# EAGLE design controller (EAGLE 7.5.0)
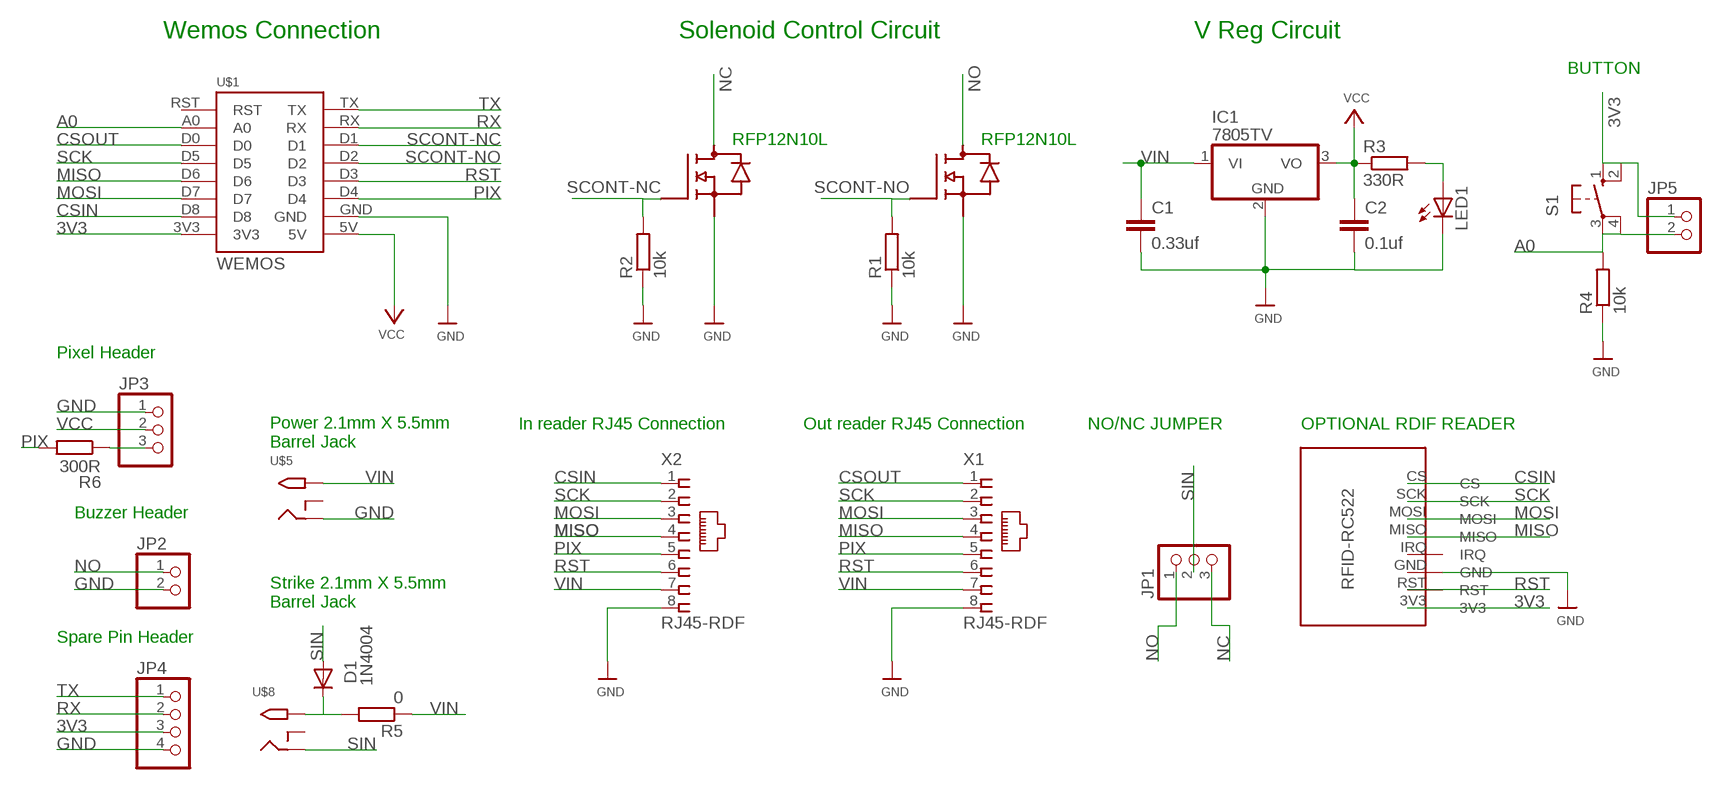
[diagram p0: schematic, sheet 1]

## Parts
C1  0.33uf  C-EU050-024X044  [C050-024X044]
C2  0.1uf  C-EU050-024X044  [C050-024X044]
D1  1N4004  [DO41-10]
IC1  7805TV  [TO220V]
IC2  NTD4963NT0220  [T0220]
IC3  NTD4963NT0220  [T0220]
JP1  PINHD-1X3CB  [1X03-CLEANBIG]
JP2  PINHD-1X2  [1X02]
JP3  PINHD-1X3CB  [1X03-CLEANBIG]
JP4  PINHD-1X4  [1X04]
JP5  PINHD-1X2  [1X02]
LED1  LED3MM  [LED3MM]
R1  10k  R-EU_0204/5  [0204/5]
R2  10k  R-EU_0204/5  [0204/5]
R3  330R  R-EU_0204/5  [0204/5]
R4  10k  R-EU_0204/5  [0204/5]
R5  0  R-EU_0204/5  [0204/5]
R6  300R  R-EU_0204/5  [0204/5]
S1  10-XX  [B3F-10XX]
U$1  WEMOS  [WEMOS]
U$5  2.1MMJACKTHM  [PJ-102A]
U$8  2.1MMJACKTHM  [PJ-102A]
U$14  RFID-RC522NOHOLES  [RFID-RC522-NOHOLES]
X1  RJ45-RDF  [RJ45-RDF]
X2  RJ45-RDF  [RJ45-RDF]

## Nets
3V3: JP4.3 JP5.1 S1.1(S) S1.2(S1) U$1.3V3 U$14.3V3
A0: JP5.2 R4.2 S1.3(P) S1.4(P1) U$1.A0
CSIN: U$1.D8 U$14.CS X2.1
CSOUT: U$1.D0 X1.1
GND: C1.2 C2.2 IC1.2(GND) IC2.3(S) IC3.3(S) JP2.2 JP3.1 JP4.4 LED1.K(C) R1.1 R2.1 R4.1 U$1.GND U$5.RING X1.8 X2.8
MISO: U$1.D6 U$14.MISO X1.4 X2.4
MOSI: U$1.D7 U$14.MOSI X1.3 X2.3
N$1: D1.C R5.2 U$8.TIP
N$4: JP3.3 R6.1
N$11: LED1.A R3.2
NC: IC2.2(D) JP1.3
NO: IC3.2(D) JP1.1 JP2.1
PIX: R6.2 U$1.D4 X1.5 X2.5
RST: U$1.D3 U$14.RST X1.6 X2.6
RX: JP4.2 U$1.RX
SCK: U$1.D5 U$14.SCK X1.2 X2.2
SCONT-NC: IC2.1(G) R2.2 U$1.D1
SCONT-NO: IC3.1(G) R1.2 U$1.D2
SIN: D1.A JP1.2 U$8.RING
TX: JP4.1 U$1.TX
VCC: C2.1 IC1.3(VO) JP3.2 R3.1 U$1.5V
VIN: C1.1 IC1.1(VI) R5.1 U$5.TIP X1.7 X2.7
Unconnected: U$1.RST U$5.RING_SW U$8.RING_SW U$14.GND U$14.IRQ

## Notes on the sheet
- Wemos Connection | Solenoid Control Circuit | V Reg Circuit
- BUTTON
- RFP12N10L | RFP12N10L
- Pixel Header
- In reader RJ45 Connection | Out reader RJ45 Connection | NO/NC JUMPER | OPTIONAL RDIF READER
- Power 2.1mm X 5.5mm
  Barrel Jack
- Buzzer Header
- Strike 2.1mm X 5.5mm
  Barrel Jack
- Spare Pin Header

## Library data of the parts
C1 C2 = rcl:C-EU: CAPACITOR, European symbol
D1 = adafruit:1N4004: DIODE General purpose 1N400x type rectifier (With bigger pads) http://www.ladyada.net/library/pcb/eaglelibrary.html
IC1 = linear:78*: Positive VOLTAGE REGULATOR Source: http://cache.national.com/ds/LM/LM78L05.pdf http://www.fairchildsemi.com/ds/LM/LM7805.pdf
IC2 IC3 = amino:NTD4963N
JP1 JP3 = adafruit:PINHD-1X3: PIN HEADER
JP2 JP5 = pinhead:PINHD-1X2: PIN HEADER
JP4 = pinhead:PINHD-1X4: PIN HEADER
LED1 = adafruit:LED: LED OSRAM: - CHIPLED LG R971, LG N971, LY N971, LG Q971, LY Q971, LO R971, LY R971 LH N974, LH R974 LS Q976, LO Q976, LY Q976 LO Q996 - Hyper CHIPLED LW Q18S LB Q993, LB Q99A, LB R99A - SideLED LS A670, LO A670, LY A670, LG A670, LP A670 LB A673, LV A673, LT A673, LW A673 LH A674 LY A675 LS A676, LA A676, LO A676, LY A676, LW A676 LS A679, LY A679, LG A679 - Hyper Micro SIDELED® LS Y876, LA Y876, LO Y876, LY Y876 LT Y87S - SmartLED LW L88C, LW L88S LB L89C, LB L89S, LG L890 LS L89K, LO L89K, LY L89K LS L896, LA L896, LO L896, LY L896 - TOPLED LS T670, LO T670, LY T670, LG T670, LP T670 LSG T670, LSP T670, LSY T670, LOP T670, LYG T670 LG T671, LOG T671, LSG T671 LB T673, LV T673, LT T673, LW T673 LH T674 LS T676, LA T676, LO T676, LY T676, LB T676, LH T676, LSB T676, LW T676 LB T67C, LV T67C, LT T67C, LS T67K, LO T67K, LY T67K, LW E67C LS E67B, LA E67B, LO E67B, LY E67B, LB E67C, LV E67C, LT E67C LW T67C LS T679, LY T679, LG T679 LS T770, LO T770, LY T770, LG T770, LP T770 LB T773, LV T773, LT T773, LW T773 LH T774 LS E675, LA E675, LY E675, LS T675 LS T776, LA T776, LO T776, LY T776, LB T776 LHGB T686 LT T68C, LB T68C - Hyper Mini TOPLED® LB M676 - Mini TOPLED Santana® LG M470 LS M47K, LO M47K, LY M47K Source: http://www.osram.convergy.de/
R1-R6 = resistor:R-EU_: RESISTOR, European symbol
S1 = switch-omron:10-XX: OMRON SWITCH; MPN: B3F-1000; OC_FARNELL: 176432; OC_NEWARK: 36M3542
U$1 = wemos:WEMOS
U$5 U$8 = adafruit:2.1MMJACK: 2.1mm x 5.5mm THM DC jack with internal switch. Digikey part #PJ-102A, 4UCON part #05537 2.1mm x 5.5mm SMT DC jack with internal switch. Digikey part #PJ-002A-SMT, 4UCON part #03267 By microbuilder.eu & adafruit.com
U$14 = Rdf:RFID-RC522
X1 X2 = con-tycoelectronics:RJ45-RDF

## Board
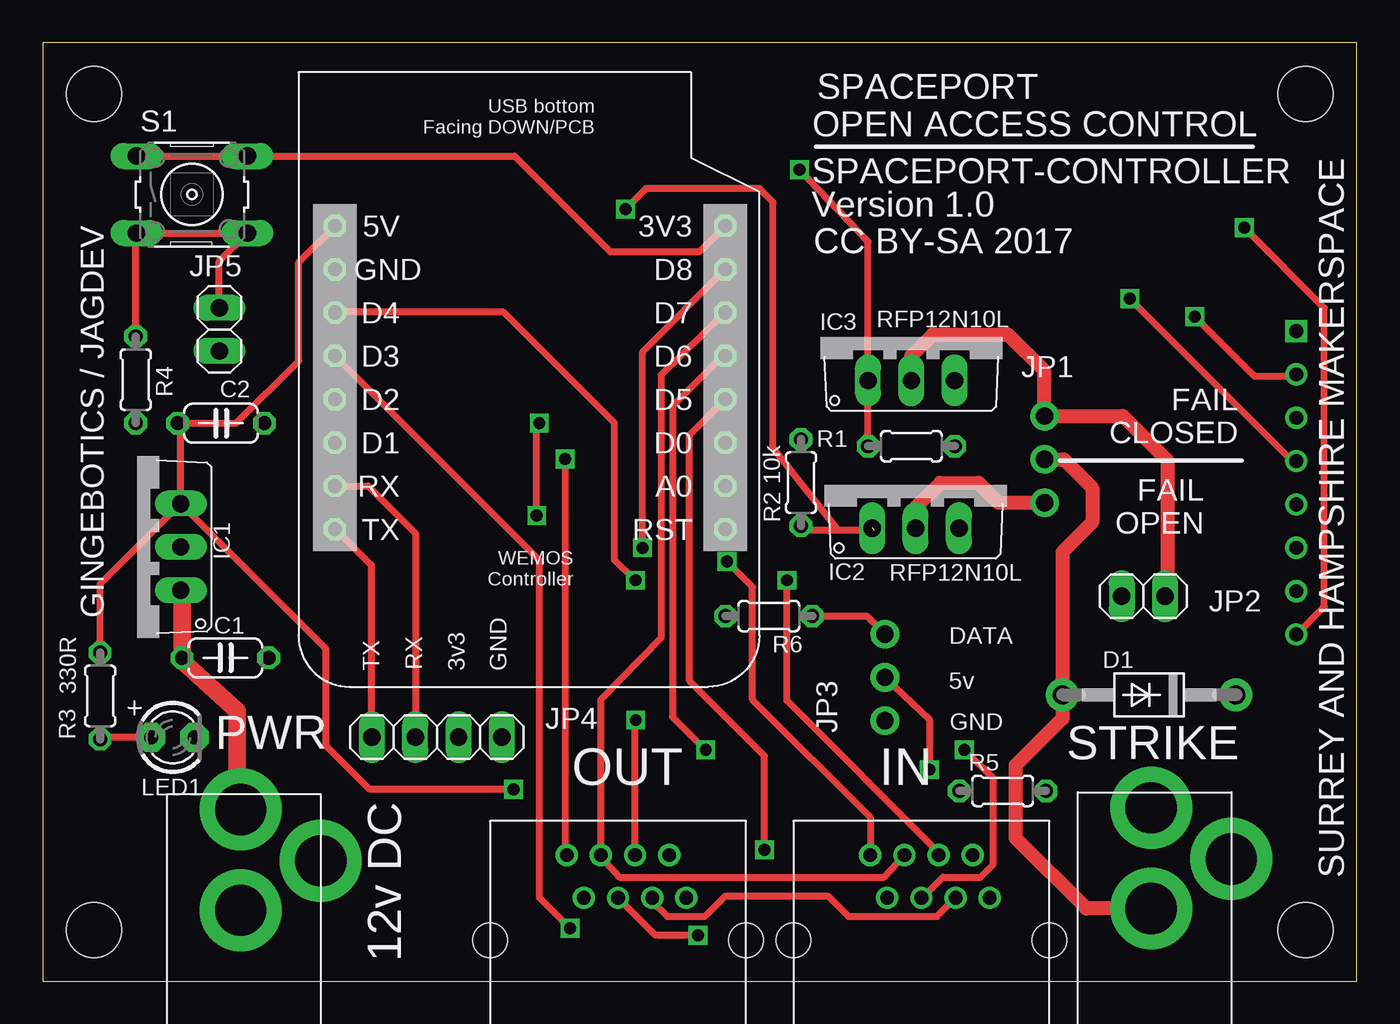
[diagram p1: board, top side]
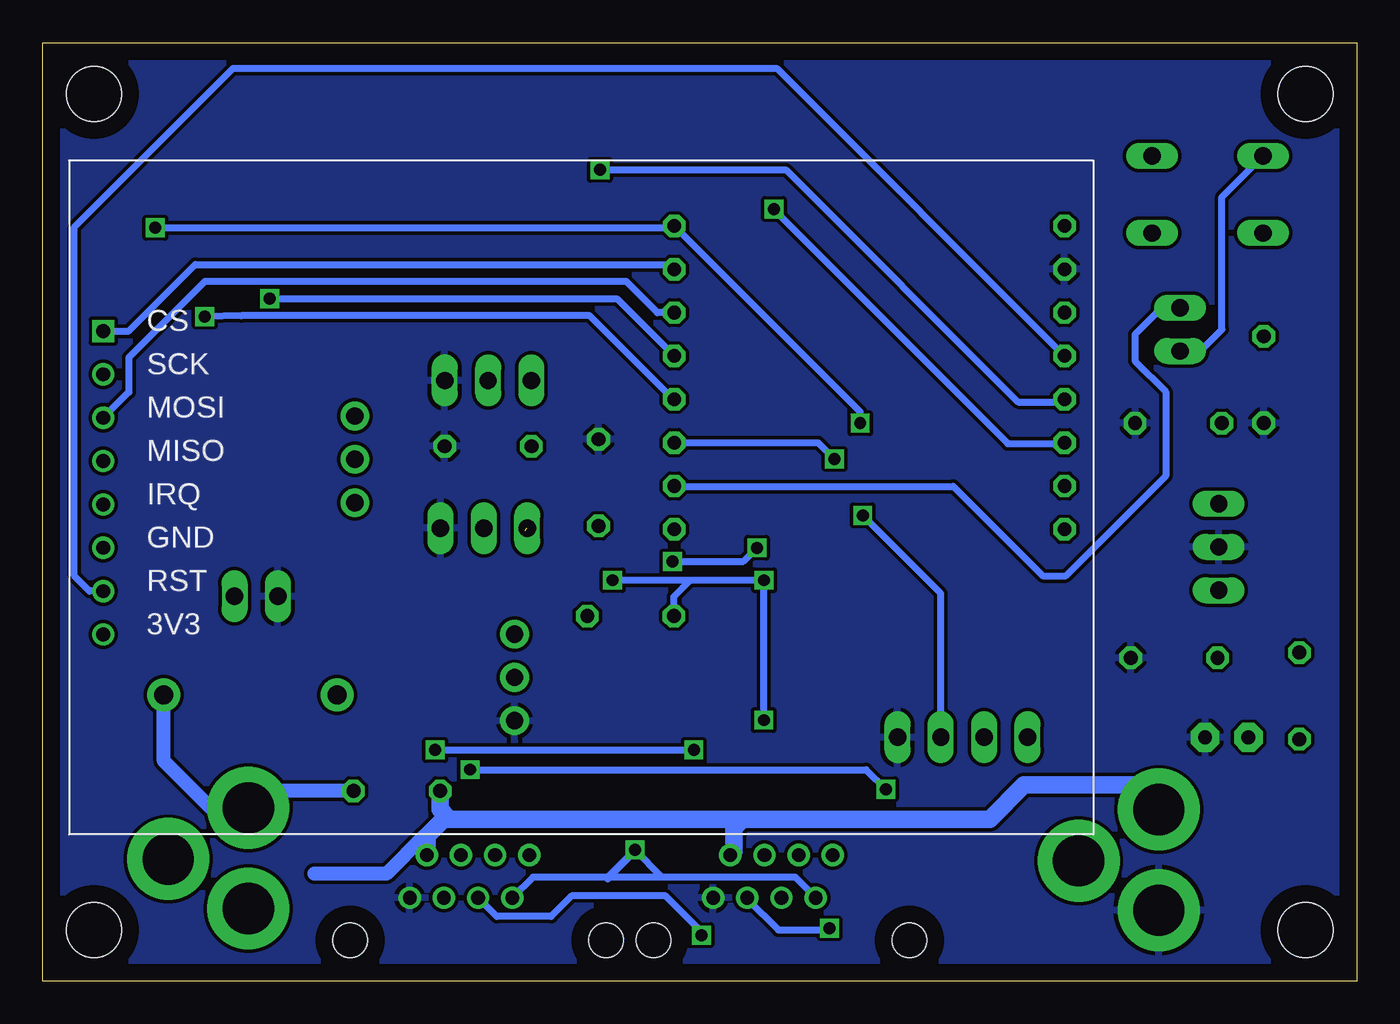
[diagram p2: board, bottom side, seen from below]

Size 77 x 55 mm. Coordinates in mm from the lower left corner, seen from the top.
Outline: 0,0 77,0 77,55 0,55 0,0
Copper layers (1*16): Top 0.035mm / dielectric 1.5mm / Bottom 0.035mm
Design rules "default *": minimum track width 10mil, minimum drill 24mil, track to track 8mil, track to pad 8mil, pad to pad 8mil, via to via 8mil, smd to smd 8mil, copper to edge 40mil, drill to drill 8mil, minimum pad ring 10mil, minimum via ring 8mil, stop-mask expansion 4mil, vias tented up to drill 28mil, thermal gap 10mil
Holes 3.2 mm at 3,3 74,3 3,52 74,52

### Footprints (pad centres in the part's own frame; a part is rotated, then mirrored left to right if it is on the bottom)
C050-024X044 = drill 0.813 octagon: 1 -2.54,0; 2 2.54,0
DO41-10 = drill 1.118 pad 1.93: A 5.08,0; C -5.08,0
TO220V = drill 1.016 long: 1 -2.54,-2.54; 2 0,-2.54; 3 2.54,-2.54
T0220 = drill 1.016 long: 1 -2.54,0; 2 0,0; 3 2.54,0
1X03-CLEANBIG = drill 1.016 pad 1.676: 1 -2.54,0; 2 0,0; 3 2.54,0
1X02 = drill 1.016 long: 1 -1.27,0; 2 1.27,0
1X04 = drill 1.016 long: 1 -3.81,0; 2 -1.27,0; 3 1.27,0; 4 3.81,0
LED3MM = drill 0.813 pad 1.676 octagon: A -1.27,0; K 1.27,0
0204/5 = drill 0.813 octagon: 1 -2.54,0; 2 2.54,0
B3F-10XX = drill 1.016 long: 1 -3.251,2.261; 2 3.251,2.261; 3 -3.251,-2.261; 4 3.251,-2.261
WEMOS = drill 0.8 octagon: 3V3 0,0; 5V 22.86,0; A0 0,15.24; D0 0,12.7; D1 22.86,12.7; D2 22.86,10.16; D3 22.86,7.62; D4 22.86,5.08; D5 0,10.16; D6 0,7.62; D7 0,5.08; D8 0,2.54; GND 22.86,2.54; RST 0,17.78; RX 22.86,15.24; TX 22.86,17.78
PJ-102A = drill 3 pad 4.8: RING 0.1,-3.39; RING_SW -4.6,-6.29; TIP 0.1,-9.29
RFID-RC522-NOHOLES = drill 0.8: 3V3 0,-17.78; GND 0,-12.7; IRQ 0,-10.16; MISO 0,-7.62; MOSI 0,-5.08; RST 0,-15.24; SCK 0,-2.54 | drill 0.8 square: CS 0,0
RJ45-RDF = drill 0.8: 1 -0.5,2; 2 0.5,-0.5; 3 1.5,2; 4 2.5,-0.5; 5 3.5,2; 6 4.5,-0.5; 7 5.5,2; 8 6.5,-0.5 | hole 2: -5,-3; 10,-3

### Placement (x,y rotation side)
C1  10.7,18.95 0 top
C2  10.45,32.7 0 top
D1  64.83,16.78 180 top
IC1  5.55,25.45 90 top
IC2  51.15,26.55 0 top
IC3  50.9,35.2 0 top
JP1  58.71,30.58 270 top
JP2  64.49,22.56 180 top
JP3  49.35,17.8 90 top
JP4  23.1,14.3 0 top
JP5  10.35,38.2 90 top
LED1  7.62,14.29 0 top
R1  50.9,31.35 180 top
R2  44.43,29.22 270 top
R3  3.37,16.72 270 top
R4  5.45,35.25 90 top
R5  56.25,11.15 0 top
R6  42.55,21.4 180 top
S1  8.75,46.1 0 top
U$1  39.99,44.26 180 top
U$5  11.7,0.77 180 top
U$8  65.05,0.87 180 top
U$14  73.45,38.1 0 bottom
X1  31.21,5.39 0 top
X2  48.99,5.39 0 top

### Tracks (layer width: path | path; a pad name or v marks a point on that pad's centre or on a via)
3V3  (via drill 0.7)
  Top 0.406: U$14.3V3 73.47,20.32 75.1,21.95 75.1,39.45 v70.4,44.15 | S1.1 S1.2 27.64,48.36 33.25,42.75 38.48,42.75 U$1.3V3 | v28.95,27.3 28.95,32.55 v29.1,32.7
  Bottom 0.406: v70.4,44.15 40.1,44.15 U$1.3V3 29.1,33.37 v29.1,32.7 | 5.5,48.3 S1.1 7.9,45.96 7.9,38.2 9.17,36.93 JP5.1 | JP4.3 24.37,22.72 v28.95,27.3
A0
  Top 0.406: R4.2 5.45,43.79 S1.3 S1.4 10.35,42.19 JP5.2
  Bottom 0.406: U$1.A0 39.97,29 23.65,29 18.4,23.75 17.05,23.75 11.2,29.6 11.2,34.55 13,36.35 13,37.9 11.43,39.47 JP5.2
CSIN  (via drill 0.7)
  Top 0.406: X2.1 48.5,9.6 41.6,16.5 41.6,23.1 v40.1,24.6 | v35.15,25.4 35.15,36.88 U$1.D8
  Bottom 0.406: v40.1,24.6 35.95,24.6 v35.15,25.4 | U$14.CS 71.95,38.1 68.05,42 40.27,42 U$1.D8
CSOUT  (via drill 0.7)
  Top 0.406: v30.6,30.6 30.6,7.5 X1.1
  Bottom 0.406: U$1.D0 31.56,31.56 v30.6,30.6
GND
  pour Bottom: 0,55 0,0 77,-0.15 77,55
MISO  (via drill 0.7)
  Top 0.305: X2.4 51.54,4.89
  Top 0.406: U$1.D6 39.84,36.64 36.9,33.7 36.9,15.5 v38.85,13.55 | v38.4,2.7 35.9,2.7 X1.4 | 51.54,4.89 52.75,6.1 54.95,6.1 55.7,6.85 55.7,11.9 v54,13.55 | U$14.MISO 73.22,30.48 v63.7,40
  Bottom 0.406: v38.4,2.7 38.2,2.7 40.5,5 46,5 47.2,3.8 50.4,3.8 X2.4 | v54,13.55 v38.85,13.55 | v63.7,40 43.35,40 U$1.D6
MOSI
  Top 0.406: X2.3 49.3,6.1 33.8,6.1 32.71,7.29 X1.3 32.71,16.51 36.25,20.15 36.25,35.54 U$1.D7
  Bottom 0.406: U$1.D7 40.98,39.18 42.8,41 67.5,41 71.95,36.55 71.95,34.52 U$14.MOSI
N$1
  Bottom 0.813: R5.2 63.96,11.15 U$8.TIP 67.16,10.16 69.9,12.9 D1.C
N$4
  Top 0.406: 45.05,21.36 R6.1 48.29,21.4 JP3.3
N$11
  Top 0.406: LED1.A 3.48,14.29 R3.2
NC
  Top 0.813: IC2.2 51.15,27.75 52.6,29.2 54.85,29.2 56,28.05 57.77,28.05 JP1.3
NO
  Top 0.813: IC3.2 50.9,36.65 52.15,37.9 56.55,37.9 58.65,35.8 58.65,33.18 JP1.1 63.28,33.12 65.9,30.5 65.9,22.7 JP2.1
PIX  (via drill 0.7)
  Top 0.406: X1.5 34.71,15.26 v34.75,15.3 | X2.5 52.49,7.56 43.6,16.45 v43.6,23.5 | v34.73,23.5 34.7,23.5 33.5,24.7 33.5,32.7 27,39.2 17.15,39.2 U$1.D4
  Bottom 0.406: v43.6,23.5 39.05,23.5 | 39.05,23.5 v34.73,23.5 34.75,16.48 v34.75,15.3 | R6.2 40.01,22.54 39.05,23.5
RST  (via drill 0.7)
  Top 0.406: X1.6 35.71,4.69 36.6,3.8 38.8,3.8 40,5 46,5 47.2,3.8 52.4,3.8 X2.6 | v30.9,3.1 29.1,4.9 29.1,24.67 U$1.D3
  Bottom 0.406: X1.6 35.71,4.81 33.9,3 31,3 v30.9,3.1 | U$14.RST 74.26,22.86 75.15,23.75 75.15,44.2 65.85,53.5 33.99,53.5 U$1.D3
RX
  Top 0.406: U$1.RX 19.08,29.02 21.85,26.25 21.85,14.32 JP4.2
SCK  (via drill 0.7)
  Top 0.406: v42.3,7.7 42.3,13.2 37.9,17.6 37.9,32.01 U$1.D5 | v67.5,38.95 71,35.45 73.34,35.45 U$14.SCK
  Bottom 0.406: X1.2 31.71,4.91 32.9,6.1 40.7,6.1 | 40.7,6.1 48.28,6.1 X2.2 | 40.7,6.1 v42.3,7.7 | v42.3,7.7 42.3,7.6 43.9,6 43.9,6.1 v42.3,7.7 | U$1.D5 40.05,34.1 44.95,39 65.35,39 v67.5,38.95
SCONT-NC  (via drill 0.7)  (1 unrouted)
  Top 0.406: 48.73,26.42 46.63,26.42 | 46.63,26.42 42.8,31.25 42.8,45.65 42,46.45 35.35,46.45 v34.15,45.25 | 46.63,26.42 44.69,26.42 R2.2
  Bottom 0.406: v34.15,45.25 34.15,45.2 20.45,31.5 17.19,31.5 U$1.D1
SCONT-NO  (via drill 0.7)
  Top 0.406: R1.2 IC3.1 48.36,43.34 v44.35,47.55
  Bottom 0.406: v44.35,47.55 33.45,47.55 19.85,33.95 17.28,33.95 U$1.D2
SIN
  Top 0.813: U$8.RING 61.14,4.26 57,8.4 57,12.65 59.75,15.4 D1.A 59.75,25.15 61.5,26.9 61.5,28.9 59.82,30.58 JP1.2
TX
  Top 0.406: U$1.TX 17.17,26.48 19.25,24.4 19.25,14.34 JP4.1
VCC  (via drill 0.7)
  Top 0.406: U$1.5V 15,42.13 15,36.35 11.35,32.7 C2.1 8.09,32.52 IC1.3 | R3.1 3.37,23.27 IC1.3 | JP3.2 51.95,15.35 v51.95,12.4 | v27.6,11.25 19.15,11.25 16.6,13.8 16.6,19.48 IC1.3
  Bottom 0.406: v51.95,12.4 28.75,12.4 v27.6,11.25
VIN
  Top 1.016: U$5.TIP 11.4,10.26 11.4,15.85 8.14,18.81 C1.1 8.16,22.84 IC1.1
  Bottom 0.813: U$5.TIP 11.6,10.1 13,11.5 | 54.49,8.51 54.64,8.51 56.85,6.3 61.09,6.3
  Bottom 1.016: 13,11.5 19.5,11.5 21.5,9.5 36,9.5 | 36,9.5 36.5,9 36.5,7.6 X1.7 | X2.7 54.49,8.51 53.5,9.5 53.15,9.5 | 53.15,9.5 36,9.5 | R5.1 53.71,10.06 53.15,9.5

### Text on the board
tPlace: SPACEPORT | OPEN ACCESS CONTROL | SPACEPORT-CONTROLLER | Version 1.0 | CC BY-SA 2017 | FAIL / CLOSED | FAIL / OPEN | GINGEBOTICS / JAGDEV | PWR | STRIKE | OUT | IN | 12v DC | SURREY AND HAMPSHIRE MAKERSPACE
tNames: RFP12N10L | RFP12N10L | DATA | TX | RX | 3v3 | GND | 5v | GND